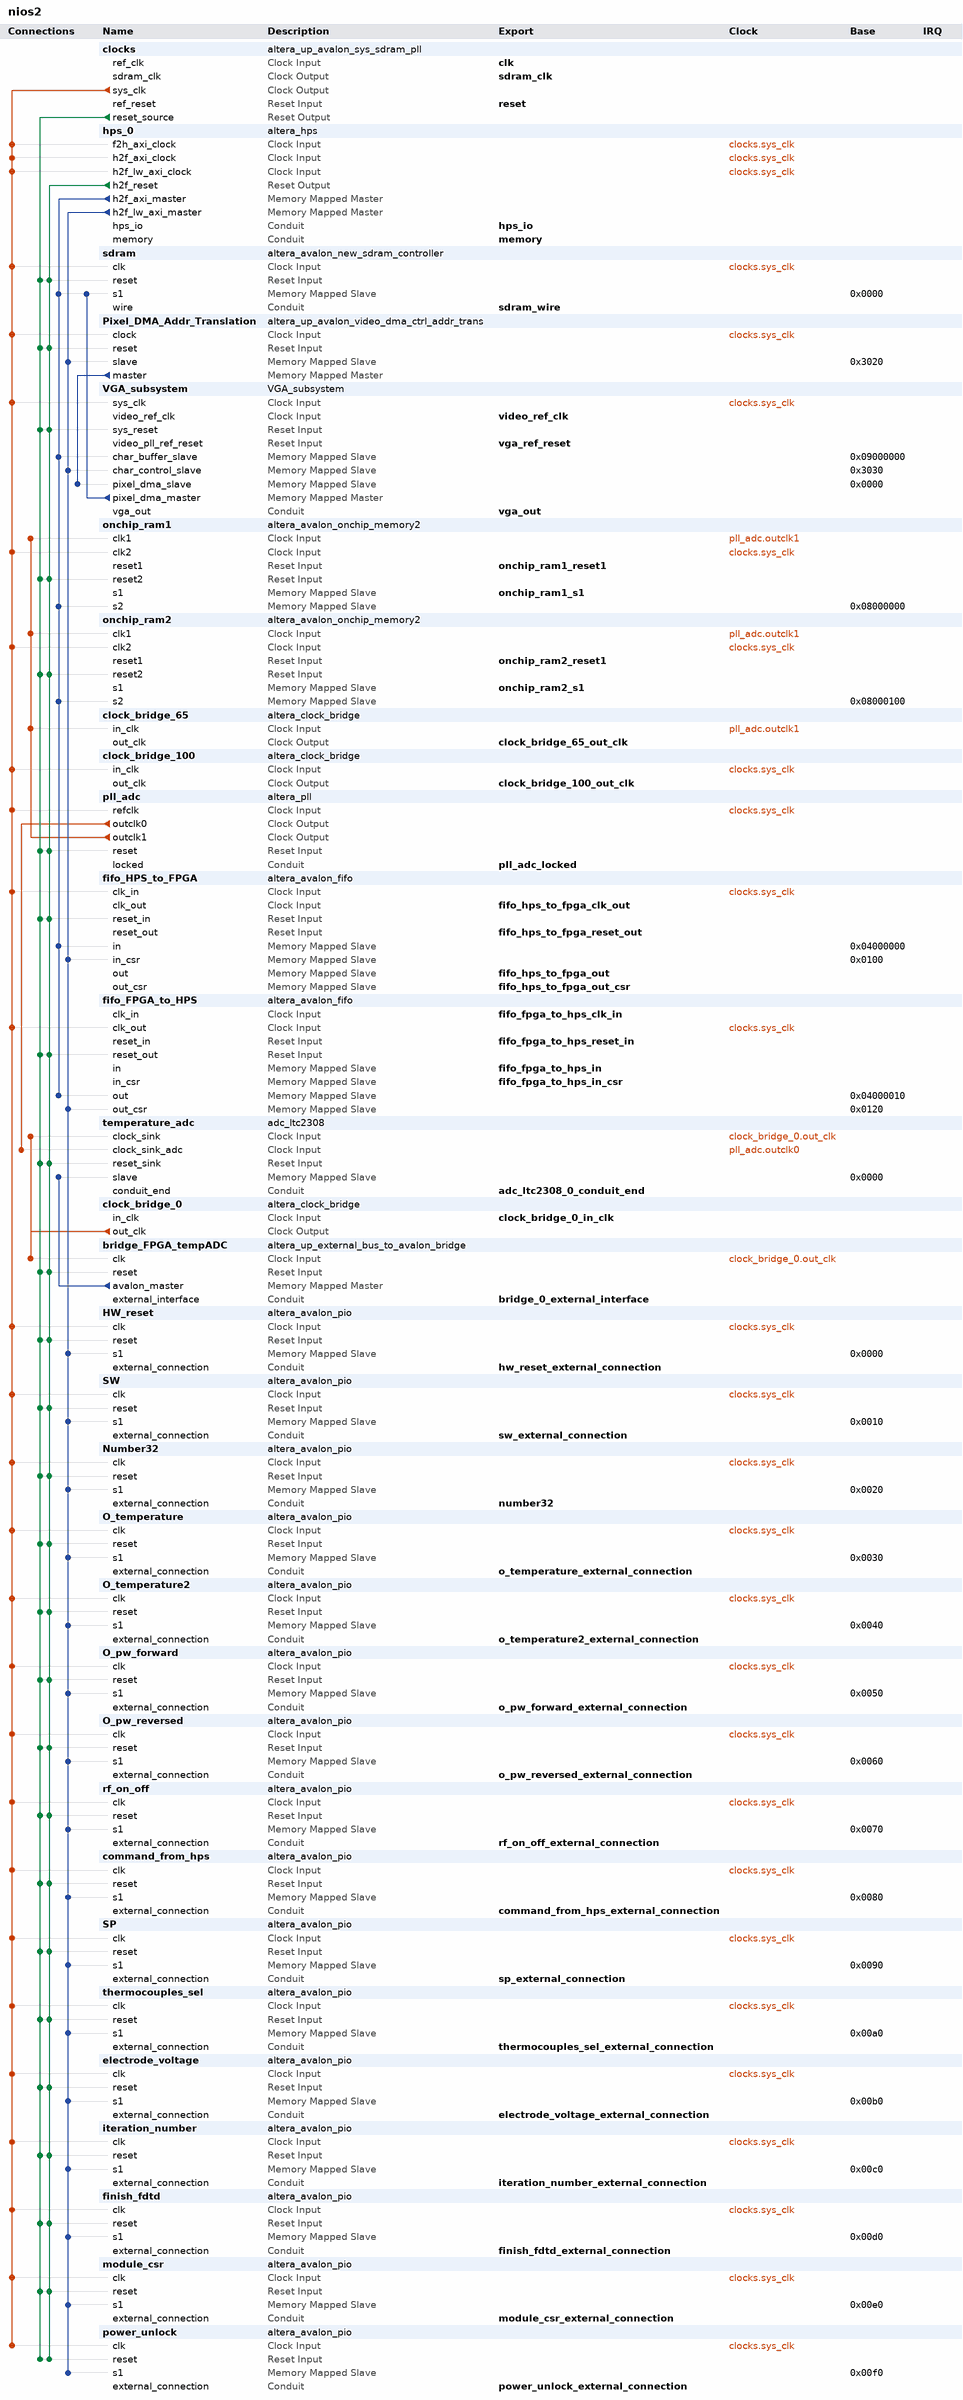
[diagram p0: system contents]
# Platform Designer (Qsys) system nios2, Cyclone V 5CSEMA5F31C6
# Parameters at their usual value, and those the tool derives, are not listed.
package require -exact qsys 16.1
create_system nios2
set_project_property DEVICE_FAMILY {Cyclone V}
set_project_property DEVICE 5CSEMA5F31C6

add_instance clocks altera_up_avalon_sys_sdram_pll 16.1
set_instance_parameter_value clocks CV_boards DE1-SoC
set_instance_parameter_value clocks gui_outclk 100.0
set_instance_parameter_value clocks gui_refclk 50.0

add_instance hps_0 altera_hps 16.1
set_instance_parameter_value hps_0 EMAC1_Mode RGMII
set_instance_parameter_value hps_0 EMAC1_PinMuxing {HPS I/O Set 0}
set_instance_parameter_value hps_0 F2SCLK_COLDRST_Enable false
set_instance_parameter_value hps_0 F2SCLK_DBGRST_Enable false
set_instance_parameter_value hps_0 F2SCLK_WARMRST_Enable false
set_instance_parameter_value hps_0 F2SINTERRUPT_Enable true
set_instance_parameter_value hps_0 F2S_Width 2
set_instance_parameter_value hps_0 FPGA_PERIPHERAL_OUTPUT_CLOCK_FREQ_EMAC0_GTX_CLK 125
set_instance_parameter_value hps_0 FPGA_PERIPHERAL_OUTPUT_CLOCK_FREQ_EMAC0_MD_CLK 2.5
set_instance_parameter_value hps_0 FPGA_PERIPHERAL_OUTPUT_CLOCK_FREQ_EMAC1_GTX_CLK 125
set_instance_parameter_value hps_0 FPGA_PERIPHERAL_OUTPUT_CLOCK_FREQ_EMAC1_MD_CLK 2.5
set_instance_parameter_value hps_0 HPS_PROTOCOL DDR3
set_instance_parameter_value hps_0 I2C0_Mode I2C
set_instance_parameter_value hps_0 I2C0_PinMuxing {HPS I/O Set 0}
set_instance_parameter_value hps_0 I2C1_Mode I2C
set_instance_parameter_value hps_0 I2C1_PinMuxing {HPS I/O Set 0}
set_instance_parameter_value hps_0 LWH2F_Enable true
set_instance_parameter_value hps_0 MEM_BANKADDR_WIDTH 3
set_instance_parameter_value hps_0 MEM_CLK_FREQ 400.0
set_instance_parameter_value hps_0 MEM_COL_ADDR_WIDTH 10
set_instance_parameter_value hps_0 MEM_DQ_WIDTH 32
set_instance_parameter_value hps_0 MEM_DRV_STR RZQ/7
set_instance_parameter_value hps_0 MEM_ROW_ADDR_WIDTH 15
set_instance_parameter_value hps_0 MEM_RTT_NOM RZQ/4
set_instance_parameter_value hps_0 MEM_RTT_WR RZQ/4
set_instance_parameter_value hps_0 MEM_TCL 11
set_instance_parameter_value hps_0 MEM_TFAW_NS 30.0
set_instance_parameter_value hps_0 MEM_TRAS_NS 35.0
set_instance_parameter_value hps_0 MEM_TRCD_NS 13.75
set_instance_parameter_value hps_0 MEM_TRFC_NS 260.0
set_instance_parameter_value hps_0 MEM_TRP_NS 13.75
set_instance_parameter_value hps_0 MEM_VENDOR JEDEC
set_instance_parameter_value hps_0 MEM_WTCL 8
set_instance_parameter_value hps_0 QSPI_Mode {1 SS}
set_instance_parameter_value hps_0 QSPI_PinMuxing {HPS I/O Set 0}
set_instance_parameter_value hps_0 REF_CLK_FREQ 25.0
set_instance_parameter_value hps_0 S2FCLK_USER2CLK 5
set_instance_parameter_value hps_0 S2F_Width 3
set_instance_parameter_value hps_0 SDIO_Mode {4-bit Data}
set_instance_parameter_value hps_0 SDIO_PinMuxing {HPS I/O Set 0}
set_instance_parameter_value hps_0 SPIM1_Mode {Single Slave Select}
set_instance_parameter_value hps_0 SPIM1_PinMuxing {HPS I/O Set 0}
set_instance_parameter_value hps_0 STM_Enable false
set_instance_parameter_value hps_0 TIMING_BOARD_AC_SKEW 0.03
set_instance_parameter_value hps_0 TIMING_BOARD_AC_TO_CK_SKEW 0.0
set_instance_parameter_value hps_0 TIMING_BOARD_DQ_TO_DQS_SKEW 0.0
set_instance_parameter_value hps_0 TIMING_BOARD_MAX_CK_DELAY 0.03
set_instance_parameter_value hps_0 TIMING_BOARD_MAX_DQS_DELAY 0.02
set_instance_parameter_value hps_0 TIMING_BOARD_SKEW_BETWEEN_DQS 0.08
set_instance_parameter_value hps_0 TIMING_BOARD_SKEW_CKDQS_DIMM_MAX 0.16
set_instance_parameter_value hps_0 TIMING_BOARD_SKEW_CKDQS_DIMM_MIN 0.09
set_instance_parameter_value hps_0 TIMING_BOARD_SKEW_WITHIN_DQS 0.01
set_instance_parameter_value hps_0 TIMING_TDH 65
set_instance_parameter_value hps_0 TIMING_TDQSCK 255
set_instance_parameter_value hps_0 TIMING_TDQSQ 125
set_instance_parameter_value hps_0 TIMING_TDS 30
set_instance_parameter_value hps_0 TIMING_TIH 140
set_instance_parameter_value hps_0 TIMING_TIS 180
set_instance_parameter_value hps_0 TIMING_TQSH 0.4
set_instance_parameter_value hps_0 UART0_Mode {No Flow Control}
set_instance_parameter_value hps_0 UART0_PinMuxing {HPS I/O Set 0}
set_instance_parameter_value hps_0 USB1_Mode SDR
set_instance_parameter_value hps_0 USB1_PinMuxing {HPS I/O Set 0}
set_instance_parameter_value hps_0 desired_cfg_clk_mhz 100.0
set_instance_parameter_value hps_0 desired_qspi_clk_mhz 400.0

add_instance sdram altera_avalon_new_sdram_controller 16.1
set_instance_parameter_value sdram TAC 5.5
set_instance_parameter_value sdram TRCD 20.0
set_instance_parameter_value sdram TRP 20.0
set_instance_parameter_value sdram casLatency 3
set_instance_parameter_value sdram columnWidth 10
set_instance_parameter_value sdram dataWidth 16
set_instance_parameter_value sdram generateSimulationModel false
set_instance_parameter_value sdram model single_Micron_MT48LC4M32B2_7_chip
set_instance_parameter_value sdram numberOfBanks 4
set_instance_parameter_value sdram numberOfChipSelects 1
set_instance_parameter_value sdram powerUpDelay 100.0
set_instance_parameter_value sdram refreshPeriod 15.625
set_instance_parameter_value sdram rowWidth 13

add_instance Pixel_DMA_Addr_Translation altera_up_avalon_video_dma_ctrl_addr_trans 16.1

add_instance VGA_subsystem VGA_subsystem 1.0

add_instance onchip_ram1 altera_avalon_onchip_memory2 16.1
set_instance_parameter_value onchip_ram1 dataWidth 16
set_instance_parameter_value onchip_ram1 dualPort true
set_instance_parameter_value onchip_ram1 initMemContent false
set_instance_parameter_value onchip_ram1 initializationFileName onchip_mem.hex
set_instance_parameter_value onchip_ram1 memorySize 256

add_instance onchip_ram2 altera_avalon_onchip_memory2 16.1
set_instance_parameter_value onchip_ram2 dataWidth 16
set_instance_parameter_value onchip_ram2 dualPort true
set_instance_parameter_value onchip_ram2 initMemContent false
set_instance_parameter_value onchip_ram2 initializationFileName onchip_mem.hex
set_instance_parameter_value onchip_ram2 memorySize 256

add_instance clock_bridge_65 altera_clock_bridge 16.1
set_instance_parameter_value clock_bridge_65 DERIVED_CLOCK_RATE 65000000
set_instance_parameter_value clock_bridge_65 EXPLICIT_CLOCK_RATE 65000000

add_instance clock_bridge_100 altera_clock_bridge 16.1
set_instance_parameter_value clock_bridge_100 DERIVED_CLOCK_RATE 100000000
set_instance_parameter_value clock_bridge_100 EXPLICIT_CLOCK_RATE 100000000

add_instance pll_adc altera_pll 16.1
set_instance_parameter_value pll_adc gui_device_speed_grade 1
set_instance_parameter_value pll_adc gui_number_of_clocks 2
set_instance_parameter_value pll_adc gui_operation_mode direct
set_instance_parameter_value pll_adc gui_output_clock_frequency0 40.0
set_instance_parameter_value pll_adc gui_output_clock_frequency1 65.0
set_instance_parameter_value pll_adc gui_pll_mode {Integer-N PLL}
set_instance_parameter_value pll_adc gui_reference_clock_frequency 100.0
set_instance_parameter_value pll_adc gui_use_locked true

add_instance fifo_HPS_to_FPGA altera_avalon_fifo 16.1
set_instance_parameter_value fifo_HPS_to_FPGA bitsPerSymbol 16
set_instance_parameter_value fifo_HPS_to_FPGA channelWidth 8
set_instance_parameter_value fifo_HPS_to_FPGA errorWidth 8
set_instance_parameter_value fifo_HPS_to_FPGA fifoDepth 128
set_instance_parameter_value fifo_HPS_to_FPGA fifoInputInterfaceOptions AVALONMM_WRITE
set_instance_parameter_value fifo_HPS_to_FPGA fifoOutputInterfaceOptions AVALONMM_READ
set_instance_parameter_value fifo_HPS_to_FPGA singleClockMode false
set_instance_parameter_value fifo_HPS_to_FPGA symbolsPerBeat 2
set_instance_parameter_value fifo_HPS_to_FPGA useBackpressure false
set_instance_parameter_value fifo_HPS_to_FPGA useIRQ false
set_instance_parameter_value fifo_HPS_to_FPGA usePacket true
set_instance_parameter_value fifo_HPS_to_FPGA useReadControl true

add_instance fifo_FPGA_to_HPS altera_avalon_fifo 16.1
set_instance_parameter_value fifo_FPGA_to_HPS bitsPerSymbol 16
set_instance_parameter_value fifo_FPGA_to_HPS channelWidth 8
set_instance_parameter_value fifo_FPGA_to_HPS errorWidth 8
set_instance_parameter_value fifo_FPGA_to_HPS fifoDepth 128
set_instance_parameter_value fifo_FPGA_to_HPS fifoInputInterfaceOptions AVALONMM_WRITE
set_instance_parameter_value fifo_FPGA_to_HPS fifoOutputInterfaceOptions AVALONMM_READ
set_instance_parameter_value fifo_FPGA_to_HPS singleClockMode false
set_instance_parameter_value fifo_FPGA_to_HPS symbolsPerBeat 2
set_instance_parameter_value fifo_FPGA_to_HPS useBackpressure false
set_instance_parameter_value fifo_FPGA_to_HPS useIRQ false
set_instance_parameter_value fifo_FPGA_to_HPS usePacket true
set_instance_parameter_value fifo_FPGA_to_HPS useReadControl true

add_instance temperature_adc adc_ltc2308 1.1

add_instance clock_bridge_0 altera_clock_bridge 16.1
set_instance_parameter_value clock_bridge_0 DERIVED_CLOCK_RATE 0
set_instance_parameter_value clock_bridge_0 EXPLICIT_CLOCK_RATE 0

add_instance bridge_FPGA_tempADC altera_up_external_bus_to_avalon_bridge 16.1
set_instance_parameter_value bridge_FPGA_tempADC addr_size 32
set_instance_parameter_value bridge_FPGA_tempADC addr_size_multiplier bytes
set_instance_parameter_value bridge_FPGA_tempADC data_size 16

add_instance HW_reset altera_avalon_pio 16.1
set_instance_parameter_value HW_reset direction Output
set_instance_parameter_value HW_reset width 8

add_instance SW altera_avalon_pio 16.1
set_instance_parameter_value SW direction Input
set_instance_parameter_value SW width 10

add_instance Number32 altera_avalon_pio 16.1
set_instance_parameter_value Number32 direction Input
set_instance_parameter_value Number32 width 32

add_instance O_temperature altera_avalon_pio 16.1
set_instance_parameter_value O_temperature direction Input
set_instance_parameter_value O_temperature width 16

add_instance O_temperature2 altera_avalon_pio 16.1
set_instance_parameter_value O_temperature2 direction Input
set_instance_parameter_value O_temperature2 width 16

add_instance O_pw_forward altera_avalon_pio 16.1
set_instance_parameter_value O_pw_forward direction Input
set_instance_parameter_value O_pw_forward width 16

add_instance O_pw_reversed altera_avalon_pio 16.1
set_instance_parameter_value O_pw_reversed direction Input
set_instance_parameter_value O_pw_reversed width 16

add_instance rf_on_off altera_avalon_pio 16.1
set_instance_parameter_value rf_on_off direction Output
set_instance_parameter_value rf_on_off width 1

add_instance command_from_hps altera_avalon_pio 16.1
set_instance_parameter_value command_from_hps direction Output
set_instance_parameter_value command_from_hps width 32

add_instance SP altera_avalon_pio 16.1
set_instance_parameter_value SP direction Output
set_instance_parameter_value SP width 20

add_instance thermocouples_sel altera_avalon_pio 16.1
set_instance_parameter_value thermocouples_sel direction Output
set_instance_parameter_value thermocouples_sel width 1

add_instance electrode_voltage altera_avalon_pio 16.1
set_instance_parameter_value electrode_voltage direction Output
set_instance_parameter_value electrode_voltage width 32

add_instance iteration_number altera_avalon_pio 16.1
set_instance_parameter_value iteration_number direction Output
set_instance_parameter_value iteration_number width 16

add_instance finish_fdtd altera_avalon_pio 16.1
set_instance_parameter_value finish_fdtd direction Input
set_instance_parameter_value finish_fdtd width 8

add_instance module_csr altera_avalon_pio 16.1
set_instance_parameter_value module_csr direction Input
set_instance_parameter_value module_csr width 16

add_instance power_unlock altera_avalon_pio 16.1
set_instance_parameter_value power_unlock direction Output
set_instance_parameter_value power_unlock width 8

# connections
add_connection clock_bridge_0.out_clk bridge_FPGA_tempADC.clk clock
add_connection clock_bridge_0.out_clk temperature_adc.clock_sink clock
add_connection clocks.sys_clk clock_bridge_100.in_clk clock
add_connection clocks.sys_clk command_from_hps.clk clock
add_connection clocks.sys_clk electrode_voltage.clk clock
add_connection clocks.sys_clk fifo_FPGA_to_HPS.clk_out clock
add_connection clocks.sys_clk fifo_HPS_to_FPGA.clk_in clock
add_connection clocks.sys_clk finish_fdtd.clk clock
add_connection clocks.sys_clk hps_0.f2h_axi_clock clock
add_connection clocks.sys_clk hps_0.h2f_axi_clock clock
add_connection clocks.sys_clk hps_0.h2f_lw_axi_clock clock
add_connection clocks.sys_clk HW_reset.clk clock
add_connection clocks.sys_clk iteration_number.clk clock
add_connection clocks.sys_clk module_csr.clk clock
add_connection clocks.sys_clk Number32.clk clock
add_connection clocks.sys_clk O_pw_forward.clk clock
add_connection clocks.sys_clk O_pw_reversed.clk clock
add_connection clocks.sys_clk O_temperature2.clk clock
add_connection clocks.sys_clk O_temperature.clk clock
add_connection clocks.sys_clk onchip_ram1.clk2 clock
add_connection clocks.sys_clk onchip_ram2.clk2 clock
add_connection clocks.sys_clk Pixel_DMA_Addr_Translation.clock clock
add_connection clocks.sys_clk pll_adc.refclk clock
add_connection clocks.sys_clk power_unlock.clk clock
add_connection clocks.sys_clk rf_on_off.clk clock
add_connection clocks.sys_clk sdram.clk clock
add_connection clocks.sys_clk SP.clk clock
add_connection clocks.sys_clk SW.clk clock
add_connection clocks.sys_clk thermocouples_sel.clk clock
add_connection clocks.sys_clk VGA_subsystem.sys_clk clock
add_connection pll_adc.outclk0 temperature_adc.clock_sink_adc clock
add_connection pll_adc.outclk1 clock_bridge_65.in_clk clock
add_connection pll_adc.outclk1 onchip_ram1.clk1 clock
add_connection pll_adc.outclk1 onchip_ram2.clk1 clock
add_connection clocks.reset_source bridge_FPGA_tempADC.reset reset
add_connection clocks.reset_source command_from_hps.reset reset
add_connection clocks.reset_source electrode_voltage.reset reset
add_connection clocks.reset_source fifo_FPGA_to_HPS.reset_out reset
add_connection clocks.reset_source fifo_HPS_to_FPGA.reset_in reset
add_connection clocks.reset_source finish_fdtd.reset reset
add_connection clocks.reset_source HW_reset.reset reset
add_connection clocks.reset_source iteration_number.reset reset
add_connection clocks.reset_source module_csr.reset reset
add_connection clocks.reset_source Number32.reset reset
add_connection clocks.reset_source O_pw_forward.reset reset
add_connection clocks.reset_source O_pw_reversed.reset reset
add_connection clocks.reset_source O_temperature2.reset reset
add_connection clocks.reset_source O_temperature.reset reset
add_connection clocks.reset_source onchip_ram1.reset2 reset
add_connection clocks.reset_source onchip_ram2.reset2 reset
add_connection clocks.reset_source Pixel_DMA_Addr_Translation.reset reset
add_connection clocks.reset_source pll_adc.reset reset
add_connection clocks.reset_source power_unlock.reset reset
add_connection clocks.reset_source rf_on_off.reset reset
add_connection clocks.reset_source sdram.reset reset
add_connection clocks.reset_source SP.reset reset
add_connection clocks.reset_source SW.reset reset
add_connection clocks.reset_source temperature_adc.reset_sink reset
add_connection clocks.reset_source thermocouples_sel.reset reset
add_connection clocks.reset_source VGA_subsystem.sys_reset reset
add_connection hps_0.h2f_reset bridge_FPGA_tempADC.reset reset
add_connection hps_0.h2f_reset command_from_hps.reset reset
add_connection hps_0.h2f_reset electrode_voltage.reset reset
add_connection hps_0.h2f_reset fifo_FPGA_to_HPS.reset_out reset
add_connection hps_0.h2f_reset fifo_HPS_to_FPGA.reset_in reset
add_connection hps_0.h2f_reset finish_fdtd.reset reset
add_connection hps_0.h2f_reset HW_reset.reset reset
add_connection hps_0.h2f_reset iteration_number.reset reset
add_connection hps_0.h2f_reset module_csr.reset reset
add_connection hps_0.h2f_reset Number32.reset reset
add_connection hps_0.h2f_reset O_pw_forward.reset reset
add_connection hps_0.h2f_reset O_pw_reversed.reset reset
add_connection hps_0.h2f_reset O_temperature2.reset reset
add_connection hps_0.h2f_reset O_temperature.reset reset
add_connection hps_0.h2f_reset onchip_ram1.reset2 reset
add_connection hps_0.h2f_reset onchip_ram2.reset2 reset
add_connection hps_0.h2f_reset Pixel_DMA_Addr_Translation.reset reset
add_connection hps_0.h2f_reset pll_adc.reset reset
add_connection hps_0.h2f_reset power_unlock.reset reset
add_connection hps_0.h2f_reset rf_on_off.reset reset
add_connection hps_0.h2f_reset sdram.reset reset
add_connection hps_0.h2f_reset SP.reset reset
add_connection hps_0.h2f_reset SW.reset reset
add_connection hps_0.h2f_reset temperature_adc.reset_sink reset
add_connection hps_0.h2f_reset thermocouples_sel.reset reset
add_connection hps_0.h2f_reset VGA_subsystem.sys_reset reset
add_connection bridge_FPGA_tempADC.avalon_master temperature_adc.slave avalon
set_connection_parameter_value bridge_FPGA_tempADC.avalon_master/temperature_adc.slave baseAddress 0x0000
add_connection hps_0.h2f_axi_master fifo_FPGA_to_HPS.out avalon
set_connection_parameter_value hps_0.h2f_axi_master/fifo_FPGA_to_HPS.out baseAddress 0x04000010
add_connection hps_0.h2f_axi_master fifo_HPS_to_FPGA.in avalon
set_connection_parameter_value hps_0.h2f_axi_master/fifo_HPS_to_FPGA.in baseAddress 0x04000000
add_connection hps_0.h2f_axi_master onchip_ram1.s2 avalon
set_connection_parameter_value hps_0.h2f_axi_master/onchip_ram1.s2 baseAddress 0x08000000
add_connection hps_0.h2f_axi_master onchip_ram2.s2 avalon
set_connection_parameter_value hps_0.h2f_axi_master/onchip_ram2.s2 baseAddress 0x08000100
add_connection hps_0.h2f_axi_master sdram.s1 avalon
set_connection_parameter_value hps_0.h2f_axi_master/sdram.s1 baseAddress 0x0000
add_connection hps_0.h2f_axi_master VGA_subsystem.char_buffer_slave avalon
set_connection_parameter_value hps_0.h2f_axi_master/VGA_subsystem.char_buffer_slave baseAddress 0x09000000
add_connection hps_0.h2f_lw_axi_master command_from_hps.s1 avalon
set_connection_parameter_value hps_0.h2f_lw_axi_master/command_from_hps.s1 baseAddress 0x0080
add_connection hps_0.h2f_lw_axi_master electrode_voltage.s1 avalon
set_connection_parameter_value hps_0.h2f_lw_axi_master/electrode_voltage.s1 baseAddress 0x00b0
add_connection hps_0.h2f_lw_axi_master fifo_FPGA_to_HPS.out_csr avalon
set_connection_parameter_value hps_0.h2f_lw_axi_master/fifo_FPGA_to_HPS.out_csr baseAddress 0x0120
add_connection hps_0.h2f_lw_axi_master fifo_HPS_to_FPGA.in_csr avalon
set_connection_parameter_value hps_0.h2f_lw_axi_master/fifo_HPS_to_FPGA.in_csr baseAddress 0x0100
add_connection hps_0.h2f_lw_axi_master finish_fdtd.s1 avalon
set_connection_parameter_value hps_0.h2f_lw_axi_master/finish_fdtd.s1 baseAddress 0x00d0
add_connection hps_0.h2f_lw_axi_master HW_reset.s1 avalon
set_connection_parameter_value hps_0.h2f_lw_axi_master/HW_reset.s1 baseAddress 0x0000
add_connection hps_0.h2f_lw_axi_master iteration_number.s1 avalon
set_connection_parameter_value hps_0.h2f_lw_axi_master/iteration_number.s1 baseAddress 0x00c0
add_connection hps_0.h2f_lw_axi_master module_csr.s1 avalon
set_connection_parameter_value hps_0.h2f_lw_axi_master/module_csr.s1 baseAddress 0x00e0
add_connection hps_0.h2f_lw_axi_master Number32.s1 avalon
set_connection_parameter_value hps_0.h2f_lw_axi_master/Number32.s1 baseAddress 0x0020
add_connection hps_0.h2f_lw_axi_master O_pw_forward.s1 avalon
set_connection_parameter_value hps_0.h2f_lw_axi_master/O_pw_forward.s1 baseAddress 0x0050
add_connection hps_0.h2f_lw_axi_master O_pw_reversed.s1 avalon
set_connection_parameter_value hps_0.h2f_lw_axi_master/O_pw_reversed.s1 baseAddress 0x0060
add_connection hps_0.h2f_lw_axi_master O_temperature2.s1 avalon
set_connection_parameter_value hps_0.h2f_lw_axi_master/O_temperature2.s1 baseAddress 0x0040
add_connection hps_0.h2f_lw_axi_master O_temperature.s1 avalon
set_connection_parameter_value hps_0.h2f_lw_axi_master/O_temperature.s1 baseAddress 0x0030
add_connection hps_0.h2f_lw_axi_master Pixel_DMA_Addr_Translation.slave avalon
set_connection_parameter_value hps_0.h2f_lw_axi_master/Pixel_DMA_Addr_Translation.slave baseAddress 0x3020
add_connection hps_0.h2f_lw_axi_master power_unlock.s1 avalon
set_connection_parameter_value hps_0.h2f_lw_axi_master/power_unlock.s1 baseAddress 0x00f0
add_connection hps_0.h2f_lw_axi_master rf_on_off.s1 avalon
set_connection_parameter_value hps_0.h2f_lw_axi_master/rf_on_off.s1 baseAddress 0x0070
add_connection hps_0.h2f_lw_axi_master SP.s1 avalon
set_connection_parameter_value hps_0.h2f_lw_axi_master/SP.s1 baseAddress 0x0090
add_connection hps_0.h2f_lw_axi_master SW.s1 avalon
set_connection_parameter_value hps_0.h2f_lw_axi_master/SW.s1 baseAddress 0x0010
add_connection hps_0.h2f_lw_axi_master thermocouples_sel.s1 avalon
set_connection_parameter_value hps_0.h2f_lw_axi_master/thermocouples_sel.s1 baseAddress 0x00a0
add_connection hps_0.h2f_lw_axi_master VGA_subsystem.char_control_slave avalon
set_connection_parameter_value hps_0.h2f_lw_axi_master/VGA_subsystem.char_control_slave baseAddress 0x3030
add_connection Pixel_DMA_Addr_Translation.master VGA_subsystem.pixel_dma_slave avalon
set_connection_parameter_value Pixel_DMA_Addr_Translation.master/VGA_subsystem.pixel_dma_slave baseAddress 0x0000
add_connection VGA_subsystem.pixel_dma_master sdram.s1 avalon
set_connection_parameter_value VGA_subsystem.pixel_dma_master/sdram.s1 baseAddress 0x0000

# exported interfaces
add_interface adc_ltc2308_0_conduit_end conduit end
set_interface_property adc_ltc2308_0_conduit_end EXPORT_OF temperature_adc.conduit_end
add_interface bridge_0_external_interface conduit end
set_interface_property bridge_0_external_interface EXPORT_OF bridge_FPGA_tempADC.external_interface
add_interface clk clock sink
set_interface_property clk EXPORT_OF clocks.ref_clk
add_interface clock_bridge_0_in_clk clock sink
set_interface_property clock_bridge_0_in_clk EXPORT_OF clock_bridge_0.in_clk
add_interface clock_bridge_100_out_clk clock source
set_interface_property clock_bridge_100_out_clk EXPORT_OF clock_bridge_100.out_clk
add_interface clock_bridge_65_out_clk clock source
set_interface_property clock_bridge_65_out_clk EXPORT_OF clock_bridge_65.out_clk
add_interface command_from_hps_external_connection conduit end
set_interface_property command_from_hps_external_connection EXPORT_OF command_from_hps.external_connection
add_interface electrode_voltage_external_connection conduit end
set_interface_property electrode_voltage_external_connection EXPORT_OF electrode_voltage.external_connection
add_interface fifo_fpga_to_hps_clk_in clock sink
set_interface_property fifo_fpga_to_hps_clk_in EXPORT_OF fifo_FPGA_to_HPS.clk_in
add_interface fifo_fpga_to_hps_in avalon slave
set_interface_property fifo_fpga_to_hps_in EXPORT_OF fifo_FPGA_to_HPS.in
add_interface fifo_fpga_to_hps_in_csr avalon slave
set_interface_property fifo_fpga_to_hps_in_csr EXPORT_OF fifo_FPGA_to_HPS.in_csr
add_interface fifo_fpga_to_hps_reset_in reset sink
set_interface_property fifo_fpga_to_hps_reset_in EXPORT_OF fifo_FPGA_to_HPS.reset_in
add_interface fifo_hps_to_fpga_clk_out clock sink
set_interface_property fifo_hps_to_fpga_clk_out EXPORT_OF fifo_HPS_to_FPGA.clk_out
add_interface fifo_hps_to_fpga_out avalon slave
set_interface_property fifo_hps_to_fpga_out EXPORT_OF fifo_HPS_to_FPGA.out
add_interface fifo_hps_to_fpga_out_csr avalon slave
set_interface_property fifo_hps_to_fpga_out_csr EXPORT_OF fifo_HPS_to_FPGA.out_csr
add_interface fifo_hps_to_fpga_reset_out reset sink
set_interface_property fifo_hps_to_fpga_reset_out EXPORT_OF fifo_HPS_to_FPGA.reset_out
add_interface finish_fdtd_external_connection conduit end
set_interface_property finish_fdtd_external_connection EXPORT_OF finish_fdtd.external_connection
add_interface hps_io conduit end
set_interface_property hps_io EXPORT_OF hps_0.hps_io
add_interface hw_reset_external_connection conduit end
set_interface_property hw_reset_external_connection EXPORT_OF HW_reset.external_connection
add_interface iteration_number_external_connection conduit end
set_interface_property iteration_number_external_connection EXPORT_OF iteration_number.external_connection
add_interface memory conduit end
set_interface_property memory EXPORT_OF hps_0.memory
add_interface module_csr_external_connection conduit end
set_interface_property module_csr_external_connection EXPORT_OF module_csr.external_connection
add_interface number32 conduit end
set_interface_property number32 EXPORT_OF Number32.external_connection
add_interface o_pw_forward_external_connection conduit end
set_interface_property o_pw_forward_external_connection EXPORT_OF O_pw_forward.external_connection
add_interface o_pw_reversed_external_connection conduit end
set_interface_property o_pw_reversed_external_connection EXPORT_OF O_pw_reversed.external_connection
add_interface o_temperature2_external_connection conduit end
set_interface_property o_temperature2_external_connection EXPORT_OF O_temperature2.external_connection
add_interface o_temperature_external_connection conduit end
set_interface_property o_temperature_external_connection EXPORT_OF O_temperature.external_connection
add_interface onchip_ram1_reset1 reset sink
set_interface_property onchip_ram1_reset1 EXPORT_OF onchip_ram1.reset1
add_interface onchip_ram1_s1 avalon slave
set_interface_property onchip_ram1_s1 EXPORT_OF onchip_ram1.s1
add_interface onchip_ram2_reset1 reset sink
set_interface_property onchip_ram2_reset1 EXPORT_OF onchip_ram2.reset1
add_interface onchip_ram2_s1 avalon slave
set_interface_property onchip_ram2_s1 EXPORT_OF onchip_ram2.s1
add_interface pll_adc_locked conduit end
set_interface_property pll_adc_locked EXPORT_OF pll_adc.locked
add_interface power_unlock_external_connection conduit end
set_interface_property power_unlock_external_connection EXPORT_OF power_unlock.external_connection
add_interface reset reset sink
set_interface_property reset EXPORT_OF clocks.ref_reset
add_interface rf_on_off_external_connection conduit end
set_interface_property rf_on_off_external_connection EXPORT_OF rf_on_off.external_connection
add_interface sdram_clk clock source
set_interface_property sdram_clk EXPORT_OF clocks.sdram_clk
add_interface sdram_wire conduit end
set_interface_property sdram_wire EXPORT_OF sdram.wire
add_interface sp_external_connection conduit end
set_interface_property sp_external_connection EXPORT_OF SP.external_connection
add_interface sw_external_connection conduit end
set_interface_property sw_external_connection EXPORT_OF SW.external_connection
add_interface thermocouples_sel_external_connection conduit end
set_interface_property thermocouples_sel_external_connection EXPORT_OF thermocouples_sel.external_connection
add_interface vga_out conduit end
set_interface_property vga_out EXPORT_OF VGA_subsystem.vga_out
add_interface vga_ref_reset reset sink
set_interface_property vga_ref_reset EXPORT_OF VGA_subsystem.video_pll_ref_reset
add_interface video_ref_clk clock sink
set_interface_property video_ref_clk EXPORT_OF VGA_subsystem.video_ref_clk

set_interconnect_requirement {$system} qsys_mm.clockCrossingAdapter HANDSHAKE
set_interconnect_requirement {$system} qsys_mm.enableEccProtection FALSE
set_interconnect_requirement {$system} qsys_mm.insertDefaultSlave FALSE
set_interconnect_requirement {$system} qsys_mm.maxAdditionalLatency 1

save_system nios2.qsys
